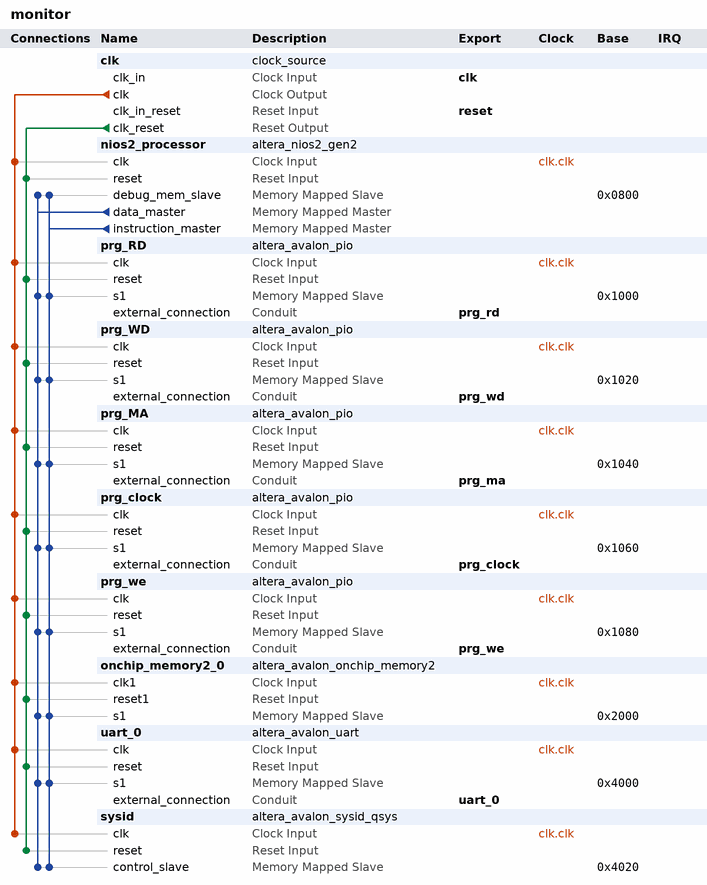
[diagram p0: system contents]
# Platform Designer (Qsys) system monitor, Cyclone V 5CEBA4F23C7
# Parameters at their usual value, and those the tool derives, are not listed.
package require -exact qsys 17.1
create_system monitor
set_project_property DEVICE_FAMILY {Cyclone V}
set_project_property DEVICE 5CEBA4F23C7

add_instance clk clock_source 17.1
set_instance_parameter_value clk clockFrequency 50000000

add_instance nios2_processor altera_nios2_gen2 17.1
set_instance_parameter_value nios2_processor dcache_size 2048
set_instance_parameter_value nios2_processor exceptionSlave onchip_memory2_0.s1
set_instance_parameter_value nios2_processor icache_size 4096
set_instance_parameter_value nios2_processor impl Tiny
set_instance_parameter_value nios2_processor resetSlave onchip_memory2_0.s1

add_instance prg_RD altera_avalon_pio 17.1
set_instance_parameter_value prg_RD direction Input
set_instance_parameter_value prg_RD width 8

add_instance prg_WD altera_avalon_pio 17.1
set_instance_parameter_value prg_WD direction Output
set_instance_parameter_value prg_WD width 8

add_instance prg_MA altera_avalon_pio 17.1
set_instance_parameter_value prg_MA direction Output
set_instance_parameter_value prg_MA width 8

add_instance prg_clock altera_avalon_pio 17.1
set_instance_parameter_value prg_clock direction Output
set_instance_parameter_value prg_clock width 1

add_instance prg_we altera_avalon_pio 17.1
set_instance_parameter_value prg_we direction Output
set_instance_parameter_value prg_we width 1

add_instance onchip_memory2_0 altera_avalon_onchip_memory2 17.1
set_instance_parameter_value onchip_memory2_0 dataWidth 32
set_instance_parameter_value onchip_memory2_0 dualPort false
set_instance_parameter_value onchip_memory2_0 initMemContent true
set_instance_parameter_value onchip_memory2_0 initializationFileName onchip_mem.hex
set_instance_parameter_value onchip_memory2_0 memorySize 8192

add_instance uart_0 altera_avalon_uart 17.1
set_instance_parameter_value uart_0 baud 9600
set_instance_parameter_value uart_0 dataBits 8
set_instance_parameter_value uart_0 fixedBaud true
set_instance_parameter_value uart_0 parity NONE
set_instance_parameter_value uart_0 stopBits 1

add_instance sysid altera_avalon_sysid_qsys 17.1
set_instance_parameter_value sysid id 0

# connections
add_connection clk.clk nios2_processor.clk clock
add_connection clk.clk onchip_memory2_0.clk1 clock
add_connection clk.clk prg_clock.clk clock
add_connection clk.clk prg_MA.clk clock
add_connection clk.clk prg_RD.clk clock
add_connection clk.clk prg_WD.clk clock
add_connection clk.clk prg_we.clk clock
add_connection clk.clk sysid.clk clock
add_connection clk.clk uart_0.clk clock
add_connection clk.clk_reset nios2_processor.reset reset
add_connection clk.clk_reset onchip_memory2_0.reset1 reset
add_connection clk.clk_reset prg_clock.reset reset
add_connection clk.clk_reset prg_MA.reset reset
add_connection clk.clk_reset prg_RD.reset reset
add_connection clk.clk_reset prg_WD.reset reset
add_connection clk.clk_reset prg_we.reset reset
add_connection clk.clk_reset sysid.reset reset
add_connection clk.clk_reset uart_0.reset reset
add_connection nios2_processor.data_master nios2_processor.debug_mem_slave avalon
set_connection_parameter_value nios2_processor.data_master/nios2_processor.debug_mem_slave baseAddress 0x0800
add_connection nios2_processor.data_master onchip_memory2_0.s1 avalon
set_connection_parameter_value nios2_processor.data_master/onchip_memory2_0.s1 baseAddress 0x2000
add_connection nios2_processor.data_master prg_clock.s1 avalon
set_connection_parameter_value nios2_processor.data_master/prg_clock.s1 baseAddress 0x1060
add_connection nios2_processor.data_master prg_MA.s1 avalon
set_connection_parameter_value nios2_processor.data_master/prg_MA.s1 baseAddress 0x1040
add_connection nios2_processor.data_master prg_RD.s1 avalon
set_connection_parameter_value nios2_processor.data_master/prg_RD.s1 baseAddress 0x1000
add_connection nios2_processor.data_master prg_WD.s1 avalon
set_connection_parameter_value nios2_processor.data_master/prg_WD.s1 baseAddress 0x1020
add_connection nios2_processor.data_master prg_we.s1 avalon
set_connection_parameter_value nios2_processor.data_master/prg_we.s1 baseAddress 0x1080
add_connection nios2_processor.data_master sysid.control_slave avalon
set_connection_parameter_value nios2_processor.data_master/sysid.control_slave baseAddress 0x4020
add_connection nios2_processor.data_master uart_0.s1 avalon
set_connection_parameter_value nios2_processor.data_master/uart_0.s1 baseAddress 0x4000
add_connection nios2_processor.instruction_master nios2_processor.debug_mem_slave avalon
set_connection_parameter_value nios2_processor.instruction_master/nios2_processor.debug_mem_slave baseAddress 0x0800
add_connection nios2_processor.instruction_master onchip_memory2_0.s1 avalon
set_connection_parameter_value nios2_processor.instruction_master/onchip_memory2_0.s1 baseAddress 0x2000
add_connection nios2_processor.instruction_master prg_clock.s1 avalon
set_connection_parameter_value nios2_processor.instruction_master/prg_clock.s1 baseAddress 0x1060
add_connection nios2_processor.instruction_master prg_MA.s1 avalon
set_connection_parameter_value nios2_processor.instruction_master/prg_MA.s1 baseAddress 0x1040
add_connection nios2_processor.instruction_master prg_RD.s1 avalon
set_connection_parameter_value nios2_processor.instruction_master/prg_RD.s1 baseAddress 0x1000
add_connection nios2_processor.instruction_master prg_WD.s1 avalon
set_connection_parameter_value nios2_processor.instruction_master/prg_WD.s1 baseAddress 0x1020
add_connection nios2_processor.instruction_master prg_we.s1 avalon
set_connection_parameter_value nios2_processor.instruction_master/prg_we.s1 baseAddress 0x1080
add_connection nios2_processor.instruction_master sysid.control_slave avalon
set_connection_parameter_value nios2_processor.instruction_master/sysid.control_slave baseAddress 0x4020
add_connection nios2_processor.instruction_master uart_0.s1 avalon
set_connection_parameter_value nios2_processor.instruction_master/uart_0.s1 baseAddress 0x4000

# exported interfaces
add_interface clk clock sink
set_interface_property clk EXPORT_OF clk.clk_in
add_interface prg_clock conduit end
set_interface_property prg_clock EXPORT_OF prg_clock.external_connection
add_interface prg_ma conduit end
set_interface_property prg_ma EXPORT_OF prg_MA.external_connection
add_interface prg_rd conduit end
set_interface_property prg_rd EXPORT_OF prg_RD.external_connection
add_interface prg_wd conduit end
set_interface_property prg_wd EXPORT_OF prg_WD.external_connection
add_interface prg_we conduit end
set_interface_property prg_we EXPORT_OF prg_we.external_connection
add_interface reset reset sink
set_interface_property reset EXPORT_OF clk.clk_in_reset
add_interface uart_0 conduit end
set_interface_property uart_0 EXPORT_OF uart_0.external_connection

set_interconnect_requirement {$system} qsys_mm.clockCrossingAdapter HANDSHAKE
set_interconnect_requirement {$system} qsys_mm.enableEccProtection FALSE
set_interconnect_requirement {$system} qsys_mm.insertDefaultSlave FALSE
set_interconnect_requirement {$system} qsys_mm.maxAdditionalLatency 1

save_system monitor.qsys
